# Altium schematic sheet Power.SchDoc
size A4; SheetNumber: 1; SheetTotal: 1
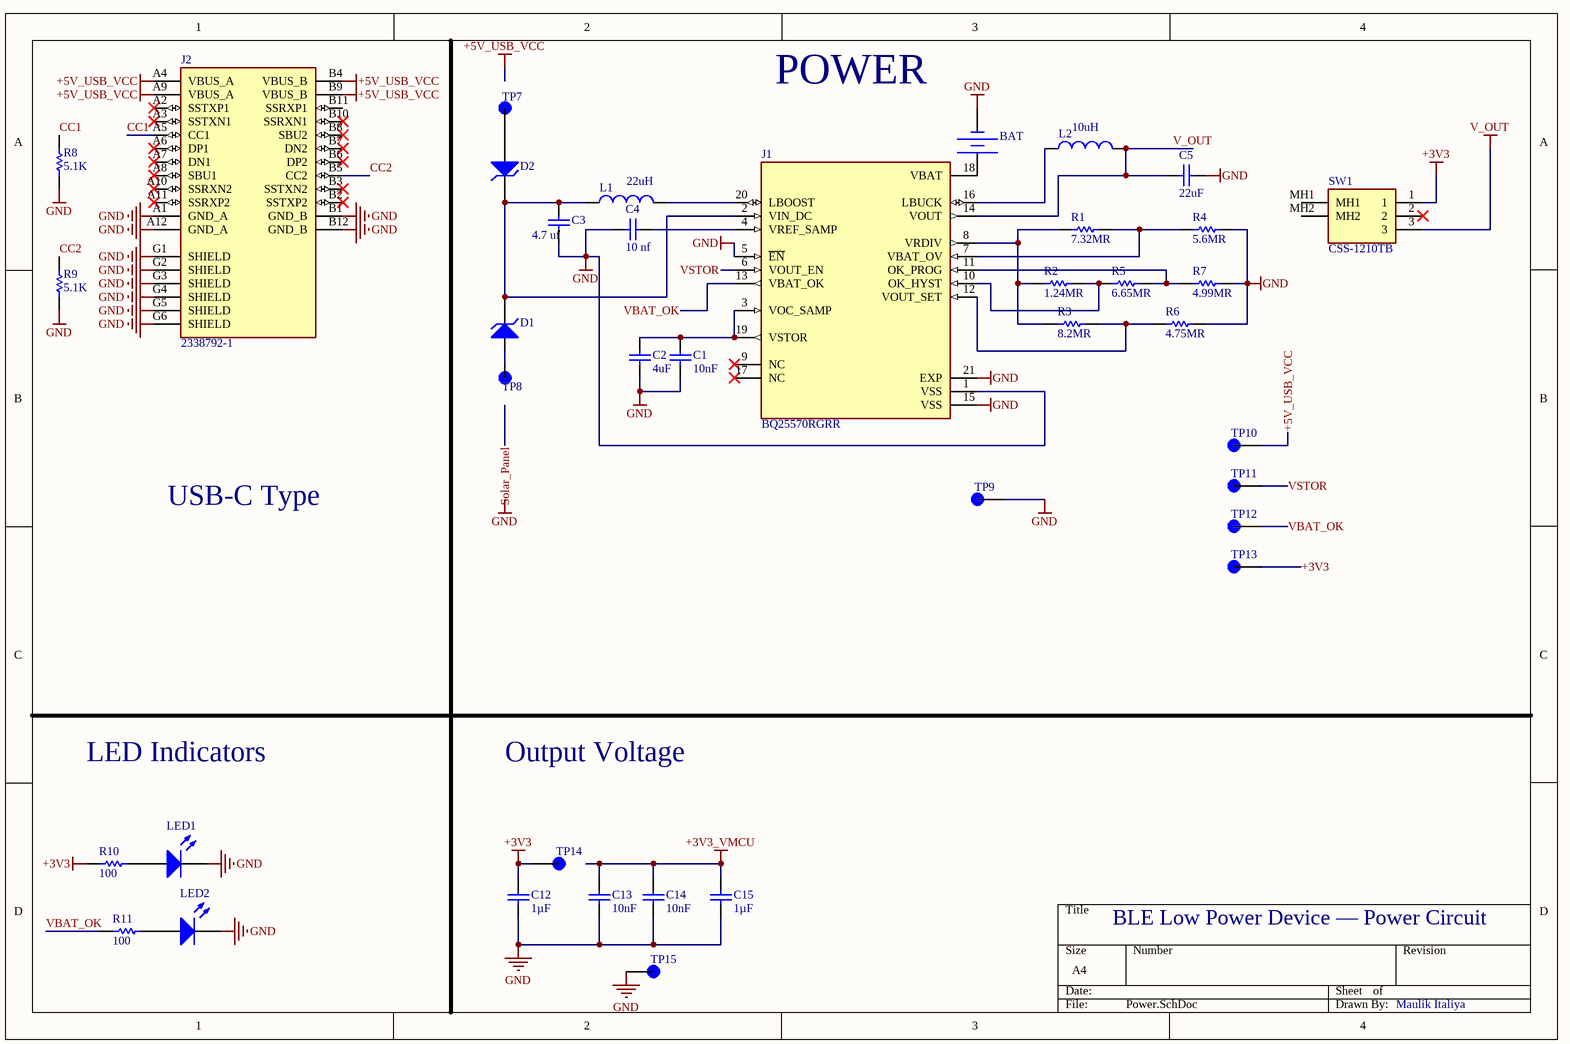
[diagram p0: Power.SchDoc]

## Parts
BAT  Constant Voltage Source  (value not drawn)
C1  value 10nF  (hidden comment: Capacitor)
C2  value 4uF  (hidden comment: Capacitor)
C3  value 4.7 uf  (hidden comment: Capacitor)
C4  value 10 nf  (hidden comment: Capacitor)
C5  value 22uF  (hidden comment: Capacitor)
C12  value 1µF  (hidden comment: Capacitor)
C13  value 10nF  (hidden comment: Capacitor)
C14  value 10nF  (hidden comment: Capacitor)
C15  value 1µF  (hidden comment: Capacitor)
D1  Zener Diode  (value not drawn)
D2  Zener Diode  (value not drawn)
J1  BQ25570RGRR  [QFN50P350X350X100-21N]
J2  2338792-1  [TE_2338792-1]
L1  value 22uH  (hidden comment: Inductor)
L2  value 10uH  (hidden comment: Inductor)
LED1  Green  (value not drawn)
LED2  Light-Emitting Diode  (value not drawn)
R1  value 7.32MR  (hidden comment: Resistor)
R2  value 1.24MR  (hidden comment: Resistor)
R3  value 8.2MR  (hidden comment: Resistor)
R4  value 5.6MR  (hidden comment: Resistor)
R5  value 6.65MR  (hidden comment: Resistor)
R6  value 4.75MR  (hidden comment: Resistor)
R7  value 4.99MR  (hidden comment: Resistor)
R8  value 5.1K  (hidden comment: Resistor)
R9  value 5.1K  (hidden comment: Resistor)
R10  value 100  (hidden comment: Resistor)
R11  value 100  (hidden comment: Resistor)
SW1  CSS-1210TB  [CSS1210TB]
TP7  (no value)  [KEYSTONE_5003]
TP8  (no value)  [KEYSTONE_5003]
TP9  (no value)  [KEYSTONE_5003]
TP10  (no value)  [KEYSTONE_5003]
TP11  (no value)  [KEYSTONE_5003]
TP12  (no value)  [KEYSTONE_5003]
TP13  (no value)  [KEYSTONE_5003]
TP14  (no value)  [KEYSTONE_5003]
TP15  (no value)  [KEYSTONE_5003]

## Nets
+3V3: C12.1 R10.2 SW1.1 TP13.TP TP14.TP
+3V3_VMCU: C13.1 C14.1 C15.1
+5V_USB_VCC: J2.A4(VBUS_A) J2.A9(VBUS_A) J2.B4(VBUS_B) J2.B9(VBUS_B) TP10.TP
GND: BAT.2 C1.1 C2.1 C3.1 C4.2 C5.2 C12.2 C13.2 C14.2 C15.2 J1.1(VSS) J1.5(~{EN}) J1.15(VSS) J1.21(EXP) J2.A1(GND_A) J2.A12(GND_A) J2.B1(GND_B) J2.B12(GND_B) J2.G1(SHIELD) J2.G2(SHIELD) J2.G3(SHIELD) J2.G4(SHIELD) J2.G5(SHIELD) J2.G6(SHIELD) LED1.2(K) LED2.2(K) R4.2 R6.2 R7.2 R8.1 R9.1 TP9.TP TP15.TP
V_OUT: C5.1 J1.14(VOUT) L2.2 SW1.3
CC1: J2.A5(CC1) R8.2
CC2: J2.B5(CC2) R9.2
VBAT_OK: J1.13(VBAT_OK) R11.2 TP12.TP
VSTOR: J1.6(VOUT_EN) TP11.TP
NetBAT_1: BAT.1 J1.18(VBAT)
NetC1_2: C1.2 C2.2 J1.3(VOC_SAMP) J1.19(VSTOR)
NetC3_2: C3.2 D1.2(K) D2.2(K) J1.2(VIN_DC) L1.1
NetC4_1: C4.1 J1.4(VREF_SAMP)
NetD1_1: D1.1(A) TP8.TP
NetD2_1: D2.1(A) TP7.TP
NetJ1_7: J1.7(VBAT_OV) R1.2 R4.1
NetJ1_8: J1.8(VRDIV) R1.1 R2.1 R3.1
NetJ1_10: J1.10(OK_HYST) R2.2 R5.1
NetJ1_11: J1.11(OK_PROG) R5.2 R7.1
NetJ1_12: J1.12(VOUT_SET) R3.2 R6.1
NetJ1_16: J1.16(LBUCK) L2.1
NetJ1_20: J1.20(LBOOST) L1.2
NetLED1_1: LED1.1(A) R10.1
NetLED2_1: LED2.1(A) R11.1

Not connected (* = marked no-connect by the designer): J1 9(NC)* 17(NC)*; J2 A2(SSTXP1)* A3(SSTXN1)* A6(DP1)* A7(DN1)* A8(SBU1)* A10(SSRXN2)* A11(SSRXP2)* B2(SSTXP2)* B3(SSTXN2)* B6(DP2)* B7(DN2)* B8(SBU2)* B10(SSRXN1)* B11(SSRXP1); SW1 2* MH1 MH2

## Notes on the sheet
- POWER
- USB-C Type
- LED Indicators
- Output Voltage
- BLE Low Power Device — Power Circuit
- Maulik Italiya
- Labels drawn without touching a wire or pin: GND

## Library data of the parts
BAT = Battery: SimulationGenericComponent: True
C1-C5 C12-C15 = Capacitor: SimulationGenericComponent: True
D1 D2 = Zener Diode: AF: 1; BV_MAX: 1e99; CJO: 0; EG: 1.11; FC: 0.5; IBV: 0.001; IS: 1e-14; MJSW: 0.33; NTUN: 30; TNOM: 27; XTI: 3; SimulationGenericComponent: True; CJP: 0; CTA: 0; CTP: 0; FCS: 0.5; FV_MAX: 1e99; IKF: 0; IKR: 0; ISR: 1e-14; JSW: 0; JTUN: 0; JTUNSW: 0; KEG: 1; KF: 0; LEVEL: 1; N: 1; NBV: 1; NR: 1; NS: 1; PHP: 1; RS: 0; TCV: 0; TLEV: 0; TLEVC: 0; TM1: 0; TM2: 0; TPB: 0; TPHP: 0; TRS: 0; TRS2: 0; TT: 0; TTT1: 0; TTT2: 0; VJ: 1; XTITUN: 3
J1 = BQ25570RGRR: Ultra Low power Harvester power Management IC with boost charger, and Nanopower Buck Converter; MF: Texas Instruments; Package: VQFN-20 Texas Instruments; Value: *; Purchase-URL: https://pricing.snapeda.com/search/part/BQ25570RGRR/?ref=eda; Availability: In Stock; MP: BQ25570RGRR; Check_prices: https://www.snapeda.com/parts/BQ25570RGRR/Texas+Instruments/view-part/?ref=eda; SnapEDA_Link: https://www.snapeda.com/parts/BQ25570RGRR/Texas+Instruments/view-part/?ref=snap; Price: None
J2 = 2338792-1: USB TYPE C 3.1 CONN REV TOP MOUNT CH1.6; MF: TE Connectivity; SnapEDA_Link: https://www.snapeda.com/parts/2338792-1/TE+Connectivity/view-part/?ref=snap; Package: None; Value: *; MP: 2338792-1; Check_prices: https://www.snapeda.com/parts/2338792-1/TE+Connectivity/view-part/?ref=eda
L1 L2 = Inductor: SimulationGenericComponent: True
LED1 = LED: Light-Emitting Diode; AF: 1; BV: 0; BV_MAX: 1e99; EG: 1.11; FC: 0.5; IBV: 0.001; IS: 1e-14; MJSW: 0.33; NTUN: 30; TNOM: 27; XTI: 3; SimulationGenericComponent: True; CJO: 0; CJP: 0; CTA: 0; CTP: 0; FCS: 0.5; FV_MAX: 1e99; IKF: 0; IKR: 0; ISR: 1e-14; JSW: 0; JTUN: 0; JTUNSW: 0; KEG: 1; KF: 0; LEVEL: 1; N: 1; NBV: 1; NR: 1; NS: 1; PHP: 1; RS: 0; TCV: 0; TLEV: 0; TLEVC: 0; TM1: 0; TM2: 0; TPB: 0; TPHP: 0; TRS: 0; TRS2: 0; TT: 0; TTT1: 0; TTT2: 0; VJ: 1; XTITUN: 3
LED2 = LED: AF: 1; BV: 0; BV_MAX: 1e99; EG: 1.11; FC: 0.5; IBV: 0.001; IS: 1e-14; MJSW: 0.33; NTUN: 30; TNOM: 27; XTI: 3; SimulationGenericComponent: True; CJO: 0; CJP: 0; CTA: 0; CTP: 0; FCS: 0.5; FV_MAX: 1e99; IKF: 0; IKR: 0; ISR: 1e-14; JSW: 0; JTUN: 0; JTUNSW: 0; KEG: 1; KF: 0; LEVEL: 1; N: 1; NBV: 1; NR: 1; NS: 1; PHP: 1; RS: 0; TCV: 0; TLEV: 0; TLEVC: 0; TM1: 0; TM2: 0; TPB: 0; TPHP: 0; TRS: 0; TRS2: 0; TT: 0; TTT1: 0; TTT2: 0; VJ: 1; XTITUN: 3
R1-R11 = Resistor: TC1: 0; SimulationGenericComponent: True; TC2: 0
SW1 = CSS-1210TB: SWITCH SLIDE SPDT 100MA 12V; Manufacturer_Name: Nidec Copal; Geometry.Height: 2.1mm; Manufacturer_Part_Number: CSS-1210TB; Mouser Part Number: 229-CSS-1210TB; Mouser Price/Stock: https://www.mouser.co.uk/ProductDetail/Nidec-Components/CSS-1210TB?qs=XeJtXLiO41RuZ%252BgY2j5i0A%3D%3D; Arrow Part Number: CSS-1210TB; Arrow Price/Stock: https://www.arrow.com/en/products/css-1210tb/nidec-copal-electronics; Datasheet Link: https://www.nidec-copal-electronics.com/e/catalog/switch/css.pdf
TP7-TP15 = 5003: Test Point Miniature THM H .300 Nylon 46 Insulated Orange PhosBronze/Silver | Keystone Electronics 5003; MF: Keystone Electronics Corp.; SnapEDA_Link: https://www.snapeda.com/parts/5003/Keystone/view-part/?ref=snap; Package: None; Value: *; MP: 5003; Check_prices: https://www.snapeda.com/parts/5003/Keystone/view-part/?ref=eda